# Altium schematic sheet power-v1v5.SchDoc
size Letter; CheckedBy: E. Chiu; CompanyName: Brinton Engineering, LLC; DrawnBy: J. Brinton; Engineer: J. Brinton; Address1: 3479 Edison Way; Address2: Menlo Park CA 94025; Address3: +1 (877) 778-8435; Address4: brintonengineering.com; Revision: 1; SheetNumber: 35; SheetTotal: 40
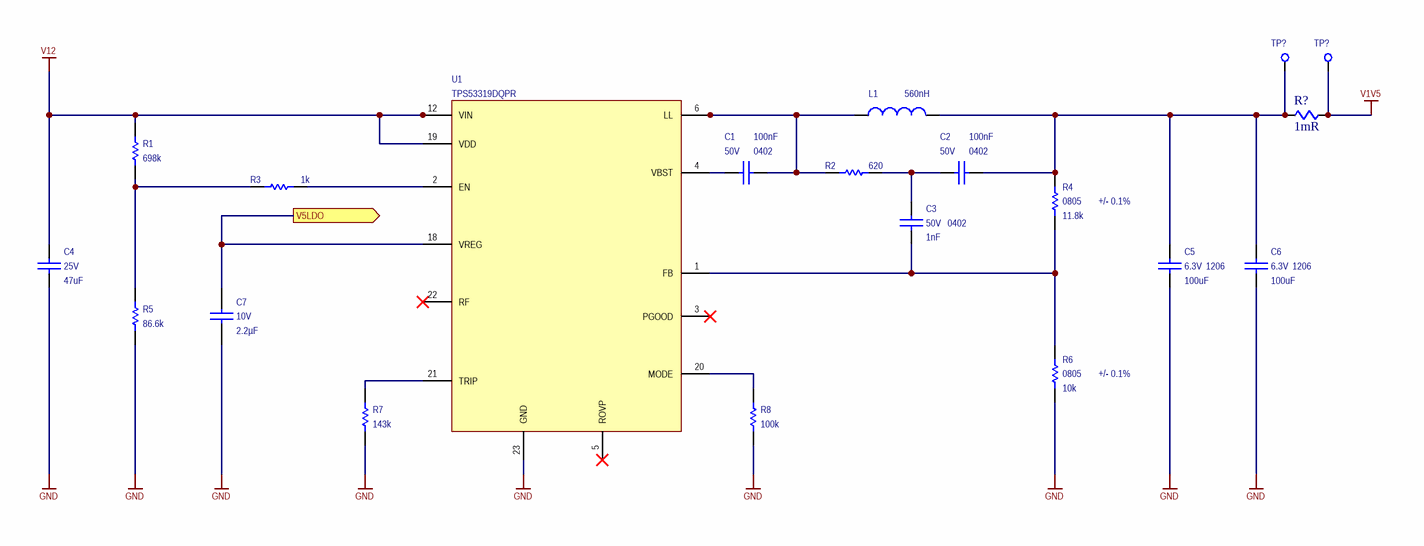
[diagram p0: power-v1v5.SchDoc]

## Parts
(Parts that share a designator on the sheet are numbered #1, #2 ... from top to bottom, then left to right.)
C1  value 100nF  Voltage: 50V  PCB Package: 0402  [CAPC1005X55N]  (hidden comment: GRM155R71H104ME14D)
C2  value 100nF  Voltage: 50V  PCB Package: 0402  [CAPC1005X55N]  (hidden comment: GRM155R71H104ME14D)
C3  value 1nF  Voltage: 50V  PCB Package: 0402  [CAPC1005X55N]  (hidden comment: GRM155R71H102KA01J)
C4  value 47uF  Voltage: 25V  [CKG57N]  (hidden comment: CKG57NX5R1E476M500JH)
C5  value 100uF  Voltage: 6.3V  PCB Package: 1206  [CAPC3216X180L55N]  (hidden comment: GRM31CR60J107ME39K)
C6  value 100uF  Voltage: 6.3V  PCB Package: 1206  [CAPC3216X180L55N]  (hidden comment: GRM31CR60J107ME39K)
C7  Voltage - Rated: 10V  Capacitance: 2.2µF  [CAPC1608X90N]  (hidden comment: GRM188R71A225KE15D)
L1  value 560nH  [XAL6030]  (hidden comment: XAL6030-561MEB)
R1  value 698k  [RESC1005X40N]  (hidden comment: ERJ-2RKF6983X)
R2  value 620  [RESC1005X40N]  (hidden comment: ERJ-2GEJ621X)
R3  value 1k  [RESC1005X40N]  (hidden comment: ERJ-2RKF1001X)
R4  value 11.8k  Tolerance: +/- 0.1%  [0805]  (hidden comment: RG2012P-1182-B-T5)
R5  value 86.6k  [RESC1005X40N]  (hidden comment: ERJ-2RKF8662X)
R6  value 10k  Tolerance: +/- 0.1%  [0805]  (hidden comment: RG2012P-103-B-T5)
R7  value 143k  [RESC1005X40N]  (hidden comment: ERJ-2RKF1433X)
R8  value 100k  [RESC1005X40N]  (hidden comment: ERJ-2GEJ104X)
R?  value 1mR  [RESC3216M-1206]  (hidden comment: Res 1mR 1/2W 1% 1206)
TP?#1  TEST_POINT_SMD_10  [TEST_POINT_SMD_10]  (value not drawn)  (no BOM)
TP?#2  TEST_POINT_SMD_10  [TEST_POINT_SMD_10]  (value not drawn)  (no BOM)
U1  TPS53319DQPR  [DQP]

## Ports
V5LDO (out)

## Nets
GND: C4.1 C5.2 C6.2 C7.1 R5.2 R6.1 R7.2 R8.2 U1.23(GND)
V1V5: R?.2 TP?#2.1
V12: C4.2 R1.1 U1.12(VIN) U1.13(VIN) U1.14(VIN) U1.15(VIN) U1.16(VIN) U1.17(VIN) U1.19(VDD)
V5LDO: C7.2 U1.18(VREG) ; port V5LDO
NetC1_1: C1.1 L1.1 R2.2 U1.6(LL) U1.7(LL) U1.8(LL) U1.9(LL) U1.10(LL) U1.11(LL)
NetC1_2: C1.2 U1.4(VBST)
NetC2_1: C2.1 C5.1 C6.1 L1.2 R4.2 R?.1 TP?#1.1
NetC2_2: C2.2 C3.1 R2.1
NetC3_2: C3.2 R4.1 R6.2 U1.1(FB)
NetR1_2: R1.2 R3.1 R5.1
NetR3_2: R3.2 U1.2(EN)
NetR7_1: R7.1 U1.21(TRIP)
NetR8_1: R8.1 U1.20(MODE)

Not connected (* = marked no-connect by the designer): U1 3(PGOOD)* 5(ROVP)* 22(RF)*

## Notes on the sheet
- Title
- Engineer
- Revision
- Drawn By
- Checked By
- Date
- Sheet
- of

## Library data of the parts
C1 C2 = CAP 0402: Ceramic Capacitor 100nF +/-20% 50V X7R 0402; Manufacturer: Murata; Manufacturer P/N: GRM155R71H104ME14D
C3 = CAP: Ceramic Capacitor 1nF +/-10% 50V X7R 0402; Manufacturer: Murata; Manufacturer P/N: GRM155R71H102KA01J; Tolerance: *; Tr: *
C4 = CAP: Stacked MLCC Capacitor 47uF +/-20% 25V SMD; Manufacturer: TDK Corporation; Tr: -55:125; Manufacturer P/N: CKG57NX5R1E476M500JH; Tolerance: +/-20%; Footprint: *
C5 C6 = CAP: Ceramic Capacitor 100uF +/-20% 6.3V X5R 1206; Manufacturer: Murata; Manufacturer P/N: GRM31CR60J107ME39K; Tolerance: *; Tr: *
C7 = GRM188R71A225KE15D: CAP CER 2.2UF 10V 10% X7R 0603; Manufacturer: Murata Electronics North America; Manufacturer P/N: GRM188R71A225KE15D; Operating Temperature: -55°C ~ 125°C; Thickness (Max): 0.035" (0.90mm); Tolerance: ±10%; Package / Case: 0603 (1608 Metric); Temperature Coefficient: X7R; Supplier 1: Newark; Supplier 2: Digi-Key; RoHS: RoHS Compliant; Size / Dimension: 0.063" L x 0.031" W (1.60mm x 0.80mm); Mounting Type: Surface Mount, MLCC; ComponentLink1URL: http://www.murata.com/~/media/webrenewal/support/library/catalog/products/capacitor/mlcc/c02e.ashx; ComponentLink1Description: http://www.murata.com/~/media/webrenewal/support/library/catalog/products/capacitor/mlcc/c02e.ashx; Supplier Part Number 1: 72R4209; Supplier Part Number 2: 490-4520-1-ND
L1 = INDUCTOR: Shielded Power Inductor 560nH, 17A; Manufacturer: Coilcraft; Manufacturer P/N: XAL6030-561MEB
R1 = RES 0402: Thick Film Resistor 698k +/-1% 0402; Manufacturer: Panasonic; PCB Package: 0402; Manufacturer P/N: ERJ-2RKF6983X
R2 = RES 0402: Thick Film Resistor 620 +/-5% 0402; Manufacturer: Panasonic; PCB Package: 0402; Manufacturer P/N: ERJ-2GEJ621X
R3 = RES 0402: Thick Film Resistor 1k +/-1% 0402; Manufacturer: Panasonic; PCB Package: 0402; Manufacturer P/N: ERJ-2RKF1001X
R4 = RES: Thin Film Resistor 11.8k +/-0.1% SMD 0805; Manufacturer: Susumu; Tr: -55:155; Tcr: *; Manufacturer P/N: RG2012P-1182-B-T5; Alternatives: *; Voltage: *; Power: *
R5 = RES 0402: Thick Film Resistor 86.6k +/-1% 0402; Manufacturer: Panasonic; PCB Package: 0402; Manufacturer P/N: ERJ-2RKF8662X
R6 = RES: Thin Film Resistor 10k +/-0.1% SMD 0805; Manufacturer: Susumu; Tr: -55:155; Tcr: *; Manufacturer P/N: RG2012P-103-B-T5; Alternatives: *; Voltage: *; Power: *
R7 = RES 0402: Thick Film Resistor 143k +/-1% 0402; Manufacturer: Panasonic; PCB Package: 0402; Manufacturer P/N: ERJ-2RKF1433X
R8 = RES 0402: Thick Film Resistor 100k +/-5% 0402; Manufacturer: Panasonic; PCB Package: 0402; Manufacturer P/N: ERJ-2GEJ104X
R? = CSR1206-0R001F1: Dist: Digi-Key; Dist P/N: 696-1369-1-ND; Mfg: Riedon; Mfgr P/N: CSR1206-0R001F1; Price: 0.57; HelpURL: http://riedon.com/media/pdf/CSR.pdf
TP?#1 TP?#2 = TEST_POINT_SMD_10: Test Point SMD
U1 = TPS53319DQPR: Manufacturer: Texas Instruments; Manufacturer P/N: TPS53319DQPR